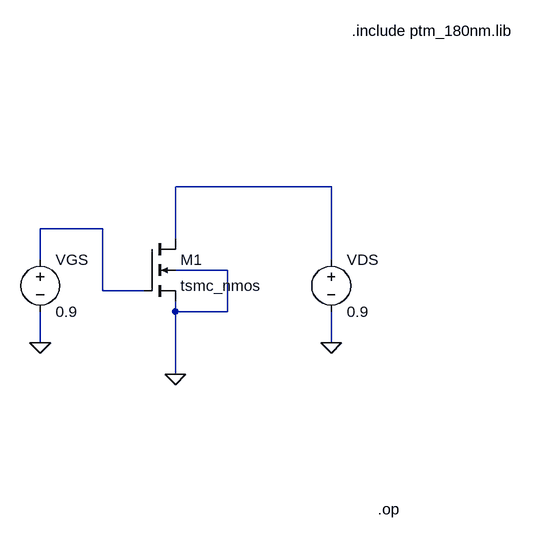
[diagram p0: schematic op_nmos.asc]
op_nmos.asc, the LTspice schematic file:
Version 4.1
SHEET 1 880 680
WIRE 304 -224 64 -224
WIRE -48 -160 -144 -160
WIRE 64 -144 64 -224
WIRE -144 -112 -144 -160
WIRE 304 -112 304 -224
WIRE 144 -96 64 -96
WIRE -48 -64 -48 -160
WIRE 16 -64 -48 -64
WIRE 64 -32 64 -48
WIRE 144 -32 144 -96
WIRE 144 -32 64 -32
WIRE -144 16 -144 -32
WIRE 304 16 304 -32
WIRE 64 64 64 -32
FLAG 64 64 0
FLAG -144 16 0
FLAG 304 16 0
SYMBOL voltage -144 -128 R0
WINDOW 123 0 0 Left 0
WINDOW 39 0 0 Left 0
SYMATTR InstName VGS
SYMATTR Value 0.9
SYMBOL voltage 304 -128 R0
WINDOW 123 0 0 Left 0
WINDOW 39 0 0 Left 0
SYMATTR InstName VDS
SYMATTR Value 0.9
SYMBOL nmos4 16 -144 R0
SYMATTR InstName M1
SYMATTR Value tsmc_nmos
SYMATTR Value2 l=0.18u w=10u
TEXT 336 -464 Left 2 !.include ptm_180nm.lib
TEXT 376 272 Left 2 !.op

The netlist it stands for:
* op_nmos.asc
VGS N002 0 0.9
VDS N001 0 0.9
M1 N001 N002 0 0 tsmc_nmos l=0.18u w=10u
.model NMOS NMOS
.model PMOS PMOS
.lib standard.mos
.include ptm_180nm.lib
.op
.backanno
.end